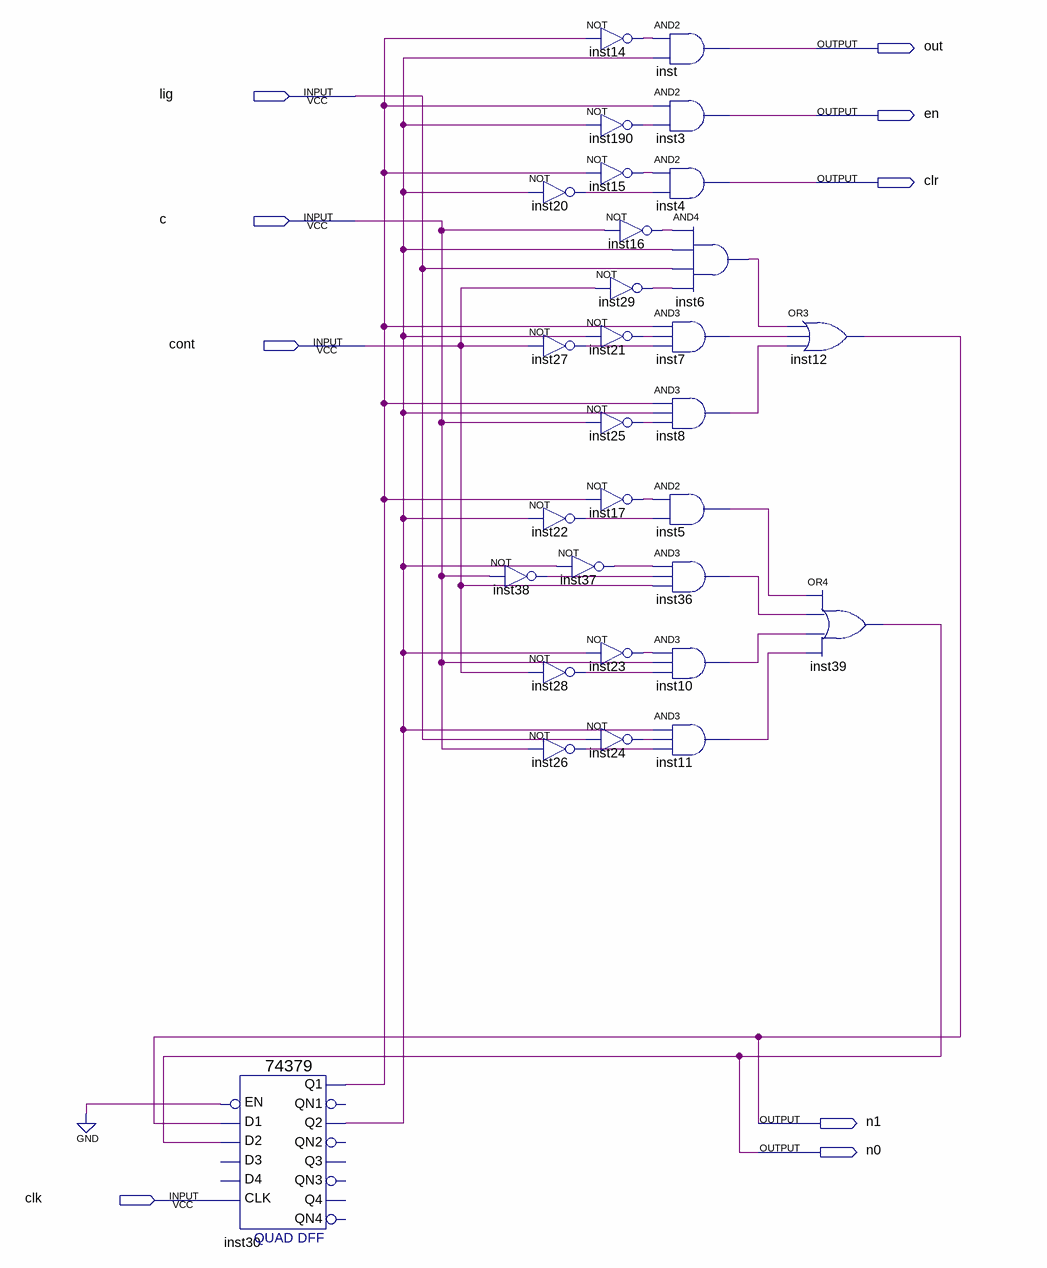
[diagram p0: schematic sheet]
// Quartus schematic bloco_c.bdf as structural Verilog: 30 symbols, 9 pins
module bloco_c (
  input  lig,
  input  c,
  input  cont,
  input  clk,
  output out,
  output en,
  output clr,
  output n1,
  output n0
);

  wire inst5_out, inst6_out, inst7_out, inst8_out, inst10_out, inst11_out, inst14_out, inst15_out,
       inst16_out, inst17_out, inst20_out, inst21_out, inst22_out, inst23_out, inst24_out, inst25_out,
       inst26_out, inst27_out, inst28_out, inst29_out, inst30_q1, inst30_q2, inst36_out, inst37_out,
       inst38_out, inst190_out;

  \74379  inst30 (
    .D1(n1), .EN(1'b0), .D2(n0), .CLK(clk), .Q2(inst30_q2), .Q1(inst30_q1));  // open: D3, D4, QN4, Q4, QN2, Q3, QN3, QN1
  not inst20 (inst20_out, inst30_q2);
  not inst27 (inst27_out, cont);
  not inst22 (inst22_out, inst30_q2);
  not inst38 (inst38_out, c);
  not inst28 (inst28_out, cont);
  not inst26 (inst26_out, c);
  not inst14 (inst14_out, inst30_q1);
  not inst190 (inst190_out, inst30_q2);
  not inst15 (inst15_out, inst30_q1);
  not inst16 (inst16_out, c);
  not inst29 (inst29_out, cont);
  not inst21 (inst21_out, inst30_q2);
  not inst25 (inst25_out, c);
  not inst17 (inst17_out, inst30_q1);
  not inst37 (inst37_out, inst30_q2);
  not inst23 (inst23_out, inst30_q2);
  not inst24 (inst24_out, lig);
  and inst (out, inst14_out, inst30_q2);
  and inst3 (en, inst30_q1, inst190_out);
  and inst4 (clr, inst15_out, inst20_out);
  and inst6 (inst6_out, inst16_out, inst30_q2, lig, inst29_out);
  and inst7 (inst7_out, inst30_q1, inst21_out, inst27_out);
  and inst8 (inst8_out, inst30_q1, inst30_q2, inst25_out);
  and inst5 (inst5_out, inst17_out, inst22_out);
  and inst36 (inst36_out, inst37_out, inst38_out, cont);
  and inst10 (inst10_out, inst23_out, c, inst28_out);
  and inst11 (inst11_out, inst30_q2, inst24_out, inst26_out);
  or inst12 (n1, inst6_out, inst7_out, inst8_out);
  or inst39 (n0, inst5_out, inst36_out, inst10_out, inst11_out);
endmodule
